# Altium schematic sheet OLED_1.5-inch_Sch.SchDoc: OLED_1.5-inch
size 152 x 127 mm; Author: Hom; CompanyName: KitSprout; DrawnBy: Hom; Engineer: Hom; Organization: KitSprout; Revision: A; SheetNumber: 1; SheetTotal: 1; Version: 1.0; LibVersion: 2.16
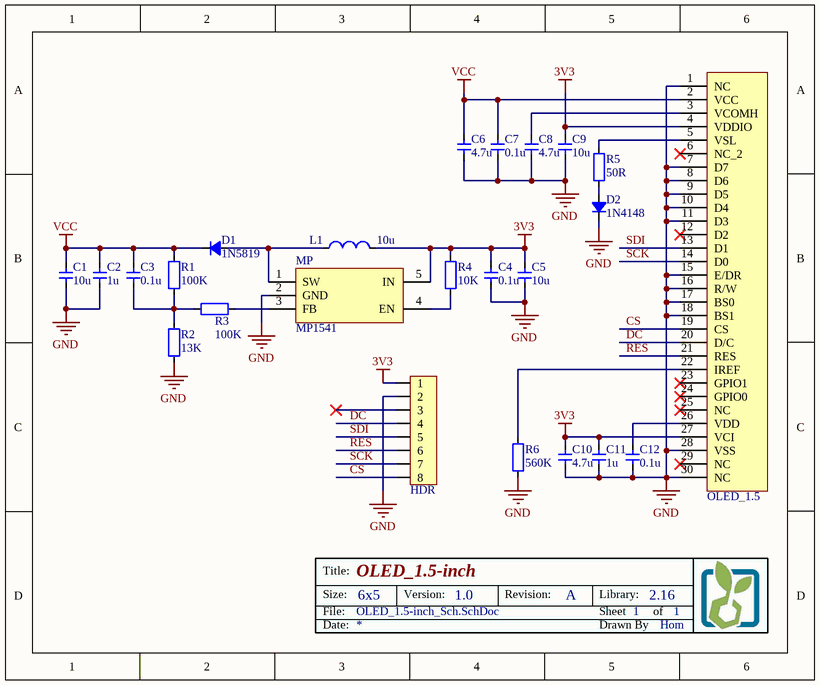
[diagram p0: OLED_1.5-inch_Sch.SchDoc]

## Parts
C1  value 10u  [CAP_0805]  (hidden comment: Cap_0805)
C2  value 1u  [CAP_0805]  (hidden comment: Cap_0805)
C3  value 0.1u  [CAP_0805]  (hidden comment: Cap_0805)
C4  value 0.1u  [CAP_0603]  (hidden comment: Cap_0603)
C5  value 10u  [CAP_0603]  (hidden comment: Cap_0603)
C6  value 4.7u  [CAP_0805]  (hidden comment: Cap_0805)
C7  value 0.1u  [CAP_0805]  (hidden comment: Cap_0805)
C8  value 4.7u  [CAP_0805]  (hidden comment: Cap_0805)
C9  value 10u  [CAP_0603]  (hidden comment: Cap_0603)
C10  value 4.7u  [CAP_0603]  (hidden comment: Cap_0603)
C11  value 1u  [CAP_0603]  (hidden comment: Cap_0603)
C12  value 0.1u  [CAP_0603]  (hidden comment: Cap_0603)
D1  value 1N5819  [SOD-123]  (hidden comment: Diode)
D2  value 1N4148  [SOD-323]  (hidden comment: Diode)
HDR  HDR1x8_2.54  [HDR1X8_2.54_180]  (value not drawn)
L1  value 10u  [IND_CD32]  (hidden comment: Ind_CD32)
MP  MP1541  [SOT23-5]
OLED_1.5  OLED_1.5_SSD1351  [OLED_1.5_128x128_SSD1351]  (value not drawn)
R1  value 100K  [RES_0603]  (hidden comment: Res_0603)
R2  value 13K  [RES_0603]  (hidden comment: Res_0603)
R3  value 100K  [RES_0603]  (hidden comment: Res_0603)
R4  value 10K  [RES_0603]  (hidden comment: Res_0603)
R5  value 50R  [RES_0603]  (hidden comment: Res_0603)
R6  value 560K  [RES_0603]  (hidden comment: Res_0603)

## Nets
3V3: C4.2 C5.2 C9.2 C10.2 C11.2 HDR.1 L1.2 MP.5(IN) OLED_1.5.4(VDDIO) OLED_1.5.27(VCI) R4.2
GND: C1.1 C2.1 C4.1 C5.1 C6.1 C7.1 C8.1 C9.1 C10.1 C11.1 C12.1 D2.2(K) HDR.2 MP.2(GND) OLED_1.5.1(NC) OLED_1.5.7(D7) OLED_1.5.8(D6) OLED_1.5.9(D5) OLED_1.5.10(D4) OLED_1.5.11(D3) OLED_1.5.15(E/DR) OLED_1.5.16(R/W) OLED_1.5.17(BS0) OLED_1.5.18(BS1) OLED_1.5.28(VSS) OLED_1.5.30(NC) R2.1 R6.2
VCC: C1.2 C2.2 C3.2 C6.2 C7.2 D1.2(K) OLED_1.5.2(VCC) R1.2
CS: HDR.8 OLED_1.5.19(CS)
DC: HDR.4 OLED_1.5.20(D/C)
RES: HDR.6 OLED_1.5.21(RES)
SCK: HDR.7 OLED_1.5.14(D0)
SDI: HDR.5 OLED_1.5.13(D1)
NetC3_1: C3.1 R1.1 R2.2 R3.2
NetC8_2: C8.2 OLED_1.5.3(VCOMH)
NetC12_2: C12.2 OLED_1.5.26(VDD)
NetD1_1: D1.1(A) L1.1 MP.1(SW)
NetD2_1: D2.1(A) R5.2
NetMP_3: MP.3(FB) R3.1
NetMP_4: MP.4(EN) R4.1
NetOLED_1.5_5: OLED_1.5.5(VSL) R5.1
NetOLED_1.5_22: OLED_1.5.22(IREF) R6.1

Not connected (* = marked no-connect by the designer): HDR 3*; OLED_1.5 6(NC_2)* 12(D2)* 23(GPIO1)* 24(GPIO0)* 25(NC)* 29(NC)*

## Notes on the sheet
- Title:
- Size:
- Date:
- File:
- 6x5
- Version:
- Revision:
- Sheet
- Drawn By
- Library:
- of

## Library data of the parts
C1-C3 C6-C8 = Cap_0805: Capacitor
C4 C5 C9-C12 = Cap_0603: Capacitor
D1 = Diode_SOD123
D2 = Diode_SOD323
HDR = HDR1x8_2.54: Header
L1 = Ind_CD32: Inductor
MP = MP1541: Boost
OLED_1.5 = OLED_1.5_SSD1351: OLED
R1-R6 = Res_0603: Resistor